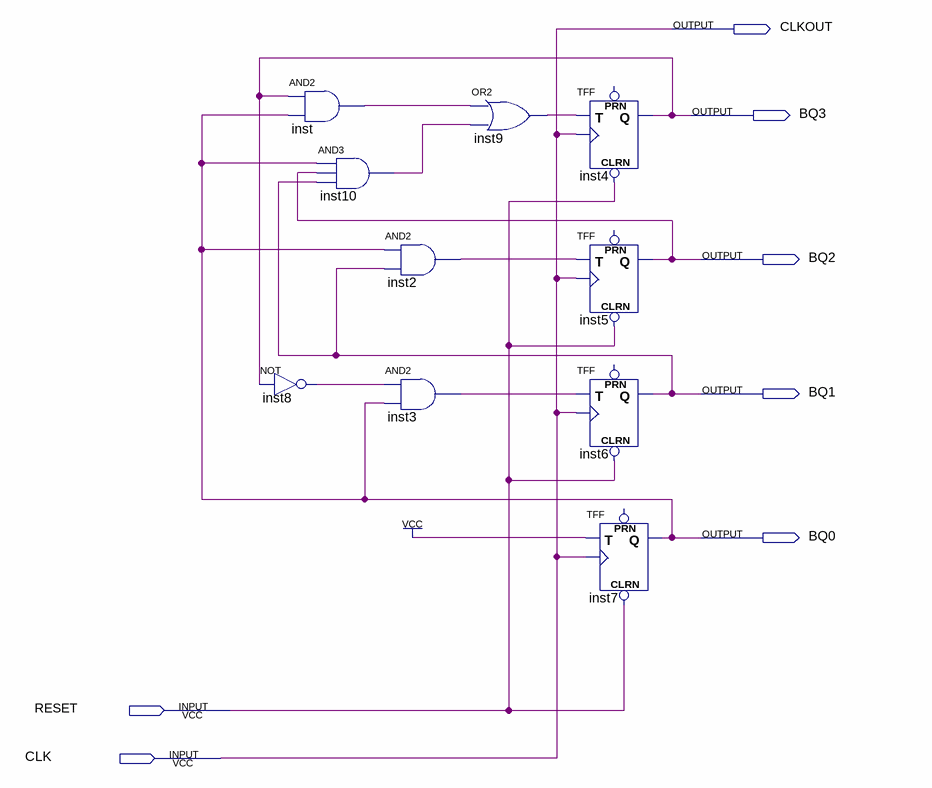
[diagram p0: schematic sheet]
// Quartus schematic 4bit_bcd_counter.bdf as structural Verilog: 10 symbols, 7 pins
module \4bit_bcd_counter  (
  input  RESET,
  input  CLK,
  output CLKOUT,
  output BQ3,
  output BQ2,
  output BQ1,
  output BQ0
);

  wire inst2_out, inst3_out, inst8_out, inst9_out, inst10_out, inst_out;

  not inst8 (inst8_out, BQ3);
  and inst (inst_out, BQ3, BQ0);
  and inst10 (inst10_out, BQ0, BQ2, BQ1);
  and inst2 (inst2_out, BQ0, BQ1);
  and inst3 (inst3_out, inst8_out, BQ0);
  or inst9 (inst9_out, inst_out, inst10_out);
  TFF inst4 (.CLRN(RESET), .T(inst9_out), .CLK(CLK), .Q(BQ3));  // open: PRN
  TFF inst5 (.CLRN(RESET), .T(inst2_out), .CLK(CLK), .Q(BQ2));  // open: PRN
  TFF inst6 (.CLRN(RESET), .T(inst3_out), .CLK(CLK), .Q(BQ1));  // open: PRN
  TFF inst7 (.CLRN(RESET), .T(1'b1), .CLK(CLK), .Q(BQ0));  // open: PRN

  assign CLKOUT = CLK;
endmodule
